# Altium project main_io.PrjPcb (part 3 of 6)

## Sheet can_uart.SchDoc: CAN and UART Interfaces
size A4; Organization: Badgerloop Electrical; Address1: 133 Engineering Research Building; Address2: 1500 Engineering Drive; Address3: Madison, Wi 53706; SheetNumber: 7
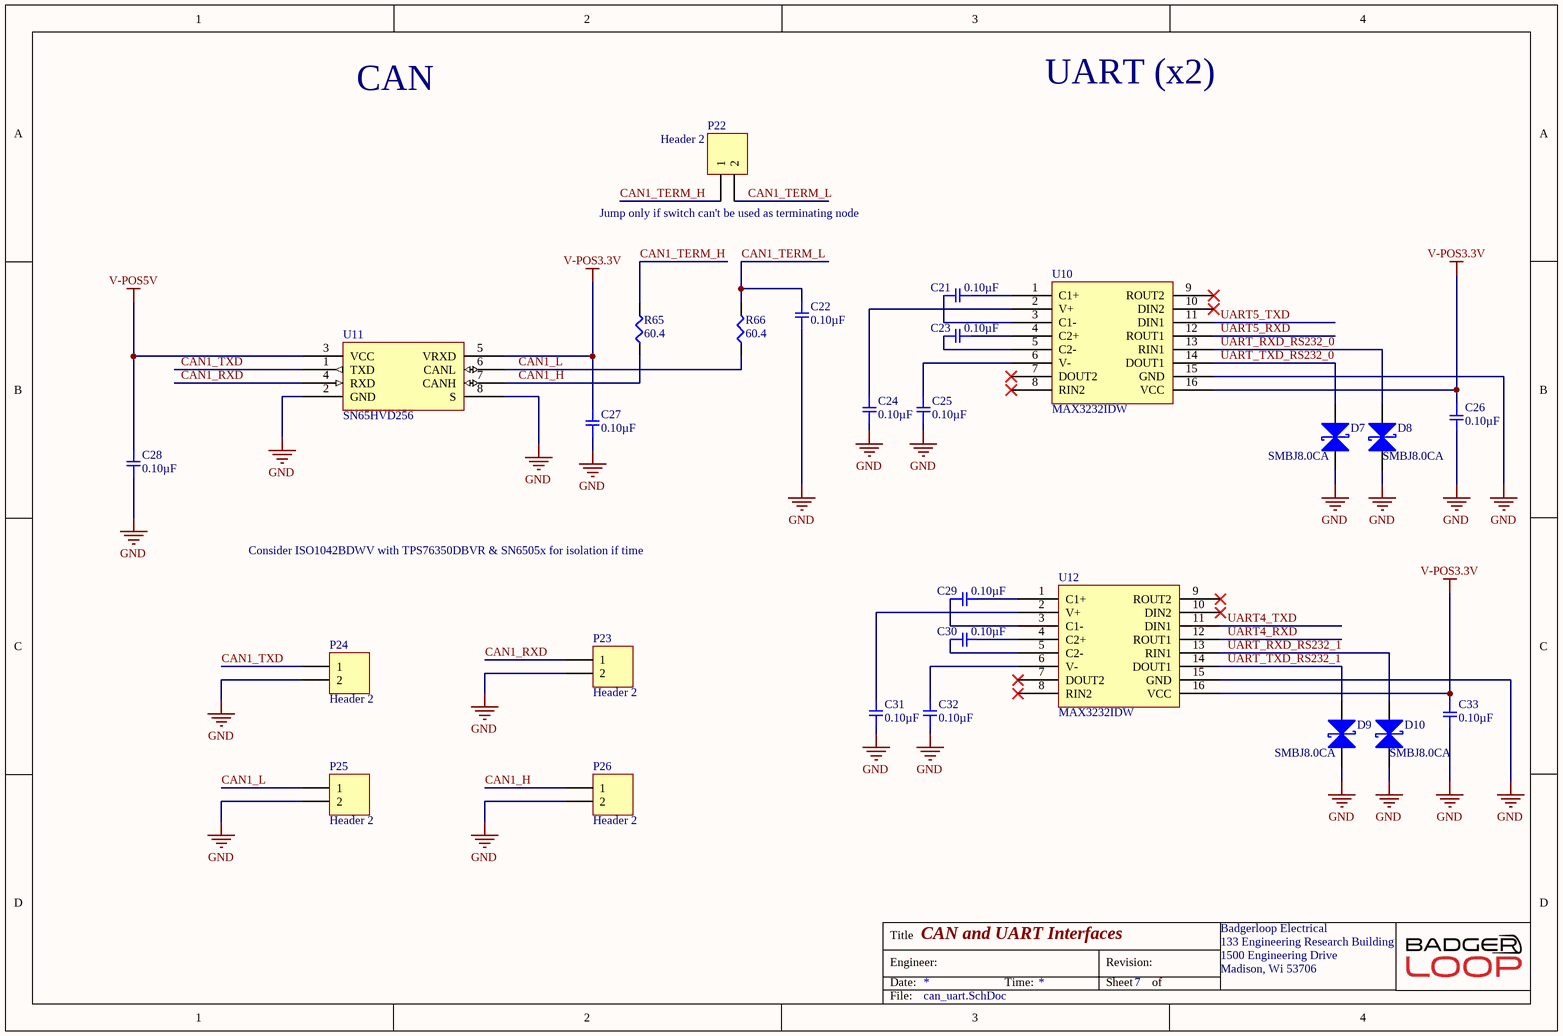
[diagram p6: can_uart.SchDoc]

### Parts
C21  0.10µF  [SMD-0805C]
C22  0.10µF  [SMD-0805C]
C23  0.10µF  [SMD-0805C]
C24  0.10µF  [SMD-0805C]
C25  0.10µF  [SMD-0805C]
C26  0.10µF  [SMD-0805C]
C27  0.10µF  [SMD-0805C]
C28  0.10µF  [SMD-0805C]
C29  0.10µF  [SMD-0805C]
C30  0.10µF  [SMD-0805C]
C31  0.10µF  [SMD-0805C]
C32  0.10µF  [SMD-0805C]
C33  0.10µF  [SMD-0805C]
D7  SMBJ8.0CA  [DIOM4436X26N]
D8  SMBJ8.0CA  [DIOM4436X26N]
D9  SMBJ8.0CA  [DIOM4436X26N]
D10  SMBJ8.0CA  [DIOM4436X26N]
P22  Header 2  [Pin Header 1x2 TH Pitch 2.54mm]
P23  Header 2  [Pin Header 1x2 TH Pitch 2.54mm]
P24  Header 2  [Pin Header 1x2 TH Pitch 2.54mm]
P25  Header 2  [Pin Header 1x2 TH Pitch 2.54mm]
P26  Header 2  [Pin Header 1x2 TH Pitch 2.54mm]
R65  60.4  [SMD-1206-RES]
R66  60.4  [SMD-1206-RES]
U10  MAX3232IDW  [SOP127P1060X175-16N]
U11  SN65HVD256  [SOIC127P610X280-8N]
U12  MAX3232IDW  [SOP127P1060X175-16N]

### Nets
GND: C22.1 C24.1 C25.1 C26.2 C27.1 C28.1 C31.1 C32.1 C33.2 D7.1(A) D8.1(A) D9.1(A) D10.1(A) P23.2 P24.2 P25.2 P26.2 U10.15(GND) U11.2(GND) U11.8(S) U12.15(GND)
V-POS3.3V: C26.1 C27.2 C33.1 U10.16(VCC) U11.5(VRXD) U12.16(VCC)
V-POS5V: C28.2 U11.3(VCC)
CAN1_H: P26.1 R65.1 U11.7(CANH)
CAN1_L: P25.1 R66.1 U11.6(CANL)
CAN1_RXD: P23.1 U11.4(RXD)
CAN1_TERM_H: P22.1 R65.2
CAN1_TERM_L: C22.2 P22.2 R66.2
CAN1_TXD: P24.1 U11.1(TXD)
UART4_RXD: U12.12(ROUT1)
UART4_TXD: U12.11(DIN1)
UART5_RXD: U10.12(ROUT1)
UART5_TXD: U10.11(DIN1)
UART_RXD_RS232_0: D8.2(K) U10.13(RIN1)
UART_RXD_RS232_1: D10.2(K) U12.13(RIN1)
UART_TXD_RS232_0: D7.2(K) U10.14(DOUT1)
UART_TXD_RS232_1: D9.2(K) U12.14(DOUT1)
NetC21_1: C21.1 U10.3(C1-)
NetC21_2: C21.2 U10.1(C1+)
NetC23_1: C23.1 U10.5(C2-)
NetC23_2: C23.2 U10.4(C2+)
NetC24_2: C24.2 U10.2(V+)
NetC25_2: C25.2 U10.6(V-)
NetC29_1: C29.1 U12.3(C1-)
NetC29_2: C29.2 U12.1(C1+)
NetC30_1: C30.1 U12.5(C2-)
NetC30_2: C30.2 U12.4(C2+)
NetC31_2: C31.2 U12.2(V+)
NetC32_2: C32.2 U12.6(V-)

Not connected (* = marked no-connect by the designer): U10 7(DOUT2)* 8(RIN2)* 9(ROUT2)* 10(DIN2)*; U12 7(DOUT2)* 8(RIN2)* 9(ROUT2)* 10(DIN2)*

### Notes on the sheet
- CAN
- UART (x2)
- (near P22) Jump only if switch can't be used as terminating node
- Consider ISO1042BDWV with TPS76350DBVR & SN6505x for isolation if time
- Title
- Engineer:
- Date:
- Time:
- Revision:
- Sheet
- of
- File:

### Library data of the parts
C21-C25 C27-C32 = GRM219R71C104JA01D: CAP CER 0.1UF 16V X7R 0805; Manufacturer: Murata Electronics North America; Factory Stock: 0; Unit Price (USD): 0.12; Minimum Quantity: 1; Tolerance: ±5%; Datasheets: -; Image: //media.digikey.com/Renders/Murata%20Renders/0805%20(2012%20Metric)%20.85mm.jpg; Digi-Key Part Number: 490-12557-1-ND; Part Number: GRM219R71C104JA01D; Quantity Available: 6635; @ qty: 0; Packaging: Cut Tape (CT); Series: GRM; Part Status: Active; Value: 0.10µF; Voltage: 16V; Temperature Coefficient: X7R; Operating Temperature: -55°C ~ 125°C; Features: -; Ratings: -; Applications: General Purpose; Mounting Type: Surface Mount, MLCC; Package / Case: 0805 (2012 Metric); Size / Dimension: 0.079" L x 0.049" W (2.00mm x 1.25mm); Height - Seated (Max): -; Thickness (Max): 0.037" (0.95mm); Lead Spacing: -; Lead Style: -
C26 C33 = GRM219R71E104KA01D: CAP CER 0.1UF 25V X7R 0805; Manufacturer: Murata Electronics North America; Factory Stock: 0; Unit Price (USD): 0.12; Minimum Quantity: 1; Tolerance: ±10%; Datasheets: http://www.murata.com/~/media/webrenewal/support/library/catalog/products/capacitor/mlcc/c02e.pdf; Image: //media.digikey.com/Renders/Murata%20Renders/0805%20(2012%20Metric)%20.85mm.jpg; Digi-Key Part Number: 490-12754-1-ND; Part Number: GRM219R71E104KA01D; Quantity Available: 8594; @ qty: 0; Packaging: Cut Tape (CT); Series: GRM; Part Status: Active; Value: 0.10µF; Voltage: 25V; Temperature Coefficient: X7R; Operating Temperature: -55°C ~ 125°C; Features: -; Ratings: -; Applications: General Purpose; Mounting Type: Surface Mount, MLCC; Package / Case: 0805 (2012 Metric); Size / Dimension: 0.079" L x 0.049" W (2.00mm x 1.25mm); Height - Seated (Max): -; Thickness (Max): 0.037" (0.95mm); Lead Spacing: -; Lead Style: -
D7-D10 = SMBJ8.0CA: TVS DIODE 8V 13.6V DO214AA; Manufacturer: Littelfuse; Polarity: Bidirectional; Peak Pulse Power: 600W; Max Surge Current: 44.2A; Breakdown Voltage: 8.89V; Test Current: 1mA; Number of Channels: 1; Leakage Current: 100uA; Power Line Protection: No; Max Breakdown Voltage: 9.83V; Supplier 1: Digi-Key; Stock 1: 700; Pricing 1: 1=0.39, 10=0.313, 25=0.2864, 100=0.1798, 250=0.17784, 500=0.1665, 1000=0.11322 (USD); Mount: Surface Mount; Case/Package: SMB; Number of Pins: 2; Min Operating Temperature: -65°C; Max Operating Temperature: 150°C; Packaging: Tape and Reel; Clamping Voltage: 13.6V; Package Quantity: 3000; Reverse Standoff Voltage: 8V; Min Breakdown Voltage: 8.89V; Peak Pulse Current: 44.2A; Direction: Bidirectional; Reverse Breakdown Voltage: 8.89V; Operating Supply Voltage: 8V; Termination: SMD/SMT; Number of Elements: 1; Number of Bidirectional Channels: 1; Composition: Zener; Max Power Dissipation: 600W; Voltage Rating (DC): 8V; Power Dissipation: 600W; Length: 5.59mm; Height: 2.44mm; Width: 3.94mm; Lead Free: Lead Free; REACH SVHC: No SVHC; ComponentLink1URL: http://www.littelfuse.com/~/media/electronics/datasheets/tvs_diodes/littelfuse_tvs_diode_smbj_datasheet.pdf.pdf?src-supplier=Digi-Key; ComponentLink1Description: http://www.littelfuse.com/~/media/electronics/datasheets/tvs_diodes/littelfuse_tvs_diode_smbj_datasheet.pdf.pdf?src-supplier=Digi-Key; ComponentLink2URL: http://www.littelfuse.com/data/en/Data_Sheets/Littelfuse_TVS-Diode_SMBJ.pdf?src-supplier=Element14; ComponentLink2Description: http://www.littelfuse.com/data/en/Data_Sheets/Littelfuse_TVS-Diode_SMBJ.pdf?src-supplier=Element14; Supplier Part Number 1: SMBJ8.0CALFCT-ND
P22-P26 = Header 2: Header, 2-Pin; LatestRevisionDate: 17-Jul-2002; LatestRevisionNote: Re-released for DXP Platform.; Publisher: Altium Limited
R65 R66 = ERJ-8ENF60R4V: RES SMD 60.4 OHM 1% 1/4W 1206; Manufacturer: Panasonic Electronic Components; Factory Stock: 0; Unit Price (USD): 0.00933; @ qty: 1500; Minimum Quantity: 1; Power (Watts): 0.25W, 1/4W; Temperature Coefficient: ±100ppm/°C; Part Number: ERJ-8ENF60R4V; Datasheets: http://industrial.panasonic.com/www-cgi/jvcr13pz.cgi?E+PZ+3+AOA0002+ERJ8ENF60R4V+7+WW; Image: //media.digikey.com/Renders/Panasonic%20Renders/ERJ-1206%20Pkg.jpg; Digi-Key Part Number: P60.4FCT-ND; Quantity Available: 94102; Packaging: Cut Tape (CT); Series: ERJ; Part Status: Active; Value: 60.4; Tolerance: ±1%; Composition: Thick Film; Features: Automotive AEC-Q200; Operating Temperature: -55°C ~ 155°C; Package / Case: 1206 (3216 Metric); Supplier Device Package: 1206; Size / Dimension: 0.126" L x 0.063" W (3.20mm x 1.60mm); Height - Seated (Max): 0.028" (0.70mm); Number of Terminations: 2; Failure Rate: -
U10 U12 = MAX3232IDW: IC DRVR/RCVR MULTCH RS232 16SOIC; Manufacturer: Texas Instruments; Number of Transmitters: 2; Max Supply Voltage: 5.5V; Min Supply Voltage: 3V; Nominal Supply Current: 1mA; Data Rate: 250Kbps; Logic Function: Transceiver,Receiver; Number of Transceivers: 1; Operating Supply Voltage: 5V; Simplex/Duplex: Full Duplex; Output Voltage: 5.4V; Output Current: 60mA; Supplier 1: Digi-Key; Stock 1: 419; Pricing 1: 1=2.15, 10=1.927, 25=1.818, 100=1.4543, 250=1.27252, 500=1.23618, 1000=0.98167, 2500=0.9604 (USD); Mount: Surface Mount; Case/Package: SOIC; Number of Pins: 16; Weight: 0.014829oz; Min Operating Temperature: -40°C; Max Operating Temperature: 85°C; Packaging: Rail/Tube; Number of Receivers: 2; Package Quantity: 40; Number of Drivers: 2; Length: 10.28mm; Width: 7.52mm; Height: 2.35mm; Radiation Hardening: No; Lead Free: Lead Free; RoHS Compliant: Yes; REACH SVHC: No SVHC; ComponentLink1URL: http://www.farnell.com/datasheets/1823586.pdf?src-supplier=Element14; ComponentLink1Description: http://www.farnell.com/datasheets/1823586.pdf?src-supplier=Element14; ComponentLink2URL: http://www.ti.com/lit/ds/symlink/max3232.pdf?src-supplier=Digi-Key; ComponentLink2Description: http://www.ti.com/lit/ds/symlink/max3232.pdf?src-supplier=Digi-Key; ComponentLink3URL: http://focus.ti.com/lit/ds/symlink/max3232.pdf?src-supplier=Avnet+Europe; ComponentLink3Description: http://focus.ti.com/lit/ds/symlink/max3232.pdf?src-supplier=Avnet+Europe; ComponentLink4URL: http://www.produktinfo.conrad.com/datenblaetter/1100000-1199999/001187156-da-01-en-IC_DRVR_RCVR_MULT_MAX3232IDW_SOIC_16_TID.pdf?src-supplier=Conrad; ComponentLink4Description: http://www.produktinfo.conrad.com/datenblaetter/1100000-1199999/001187156-da-01-en-IC_DRVR_RCVR_MULT_MAX3232IDW_SOIC_16_TID.pdf?src-supplier=Conrad; Supplier Part Number 1: 296-26159-5-ND
U11 = SN65HVD256: IC TXRX CAN 5V HS 8SOIC; Manufacturer: TI; Manufacturer P/N: SN65HVD256DR; Digikey P/N: 296-30093-1-ND; Digikey Link: https://www.digikey.com/product-detail/en/texas-instruments/SN65HVD256DR/296-30093-1-ND/2798832

## Sheet retros.SchDoc: Retros
size A4; Organization: Badgerloop Electrical; Address1: 133 Engineering Research Building; Address2: 1500 Engineering Drive; Address3: Madison, Wi 53706; SheetNumber: 8
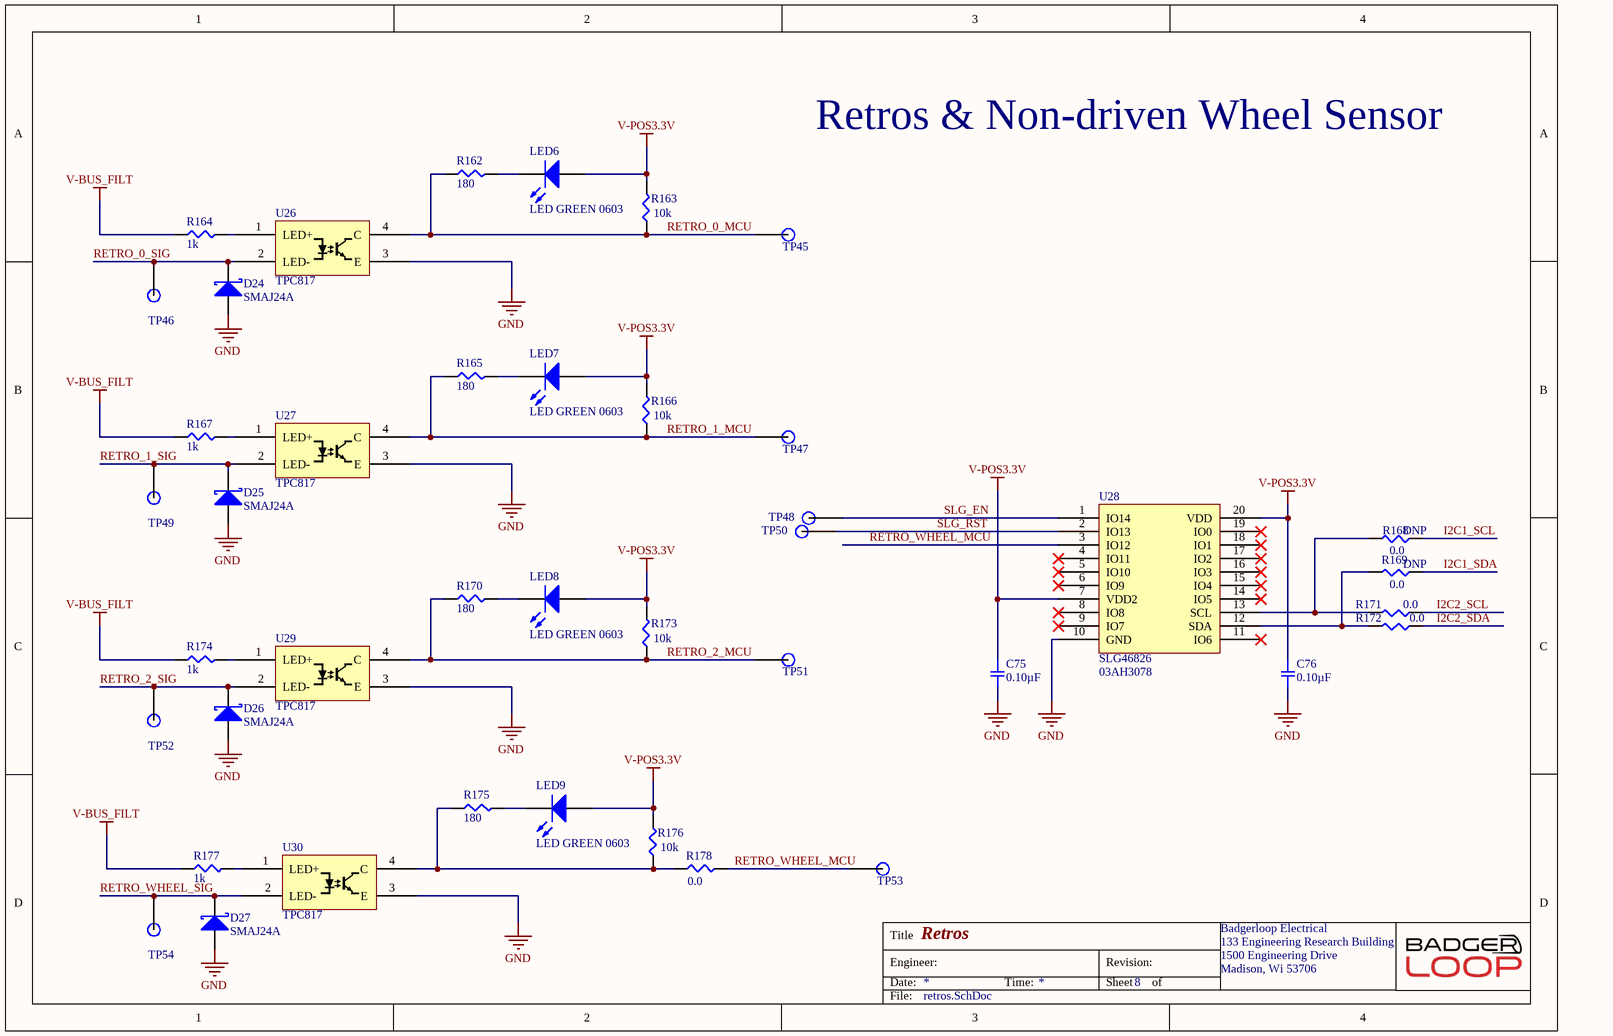
[diagram p7: retros.SchDoc]

### Parts
C75  0.10µF  [SMD-0805C]
C76  0.10µF  [SMD-0805C]
D24  SMAJ24A  [INDM5026X18N]
D25  SMAJ24A  [INDM5026X18N]
D26  SMAJ24A  [INDM5026X18N]
D27  SMAJ24A  [INDM5026X18N]
LED6  LED GREEN 0603  [LED 0603 GREEN]
LED7  LED GREEN 0603  [LED 0603 GREEN]
LED8  LED GREEN 0603  [LED 0603 GREEN]
LED9  LED GREEN 0603  [LED 0603 GREEN]
R162  180  [SMD-0805-RES]
R163  10k  [SMD-0805-RES]
R164  1k  [SMD-0805-RES]
R165  180  [SMD-0805-RES]
R166  10k  [SMD-0805-RES]
R167  1k  [SMD-0805-RES]
R168  0.0  [SMD-0805-RES]
R169  0.0  [SMD-0805-RES]
R170  180  [SMD-0805-RES]
R171  0.0  [SMD-0805-RES]
R172  0.0  [SMD-0805-RES]
R173  10k  [SMD-0805-RES]
R174  1k  [SMD-0805-RES]
R175  180  [SMD-0805-RES]
R176  10k  [SMD-0805-RES]
R177  1k  [SMD-0805-RES]
R178  0.0  [SMD-0805-RES]
TP45  TP  [Test Point]  (value not drawn)
TP46  TP  [Test Point]  (value not drawn)
TP47  TP  [Test Point]  (value not drawn)
TP48  TP  [Test Point]  (value not drawn)
TP49  TP  [Test Point]  (value not drawn)
TP50  TP  [Test Point]  (value not drawn)
TP51  TP  [Test Point]  (value not drawn)
TP52  TP  [Test Point]  (value not drawn)
TP53  TP  [Test Point]  (value not drawn)
TP54  TP  [Test Point]  (value not drawn)
U26  TPC817  [SOT200P1005X328-5N]
U27  TPC817  [SOT200P1005X328-5N]
U28  SLG46826  Supplier Part Number 1: 03AH3078  [SOP65P640X175-20N]
U29  TPC817  [SOT200P1005X328-5N]
U30  TPC817  [SOT200P1005X328-5N]

### Nets
GND: C75.2 C76.2 D24.2(K) D25.2(K) D26.2(K) D27.2(K) U26.3(E) U27.3(E) U28.10(GND) U29.3(E) U30.3(E)
V-BUS_FILT: R164.1 R167.1 R174.1 R177.1  [project net MSTR_SW +]
V-POS3.3V: C75.1 C76.1 LED6.1(A) LED7.1(A) LED8.1(A) LED9.1(A) R163.2 R166.2 R173.2 R176.2 U28.7(VDD2) U28.20(VDD)
I2C1_SCL: R168.1
I2C1_SDA: R169.1
I2C2_SCL: R171.1
I2C2_SDA: R172.1
RETRO_0_MCU: R162.1 R163.1 TP45.1 U26.4(C)
RETRO_0_SIG: D24.1(A) TP46.1 U26.2(LED-)
RETRO_1_MCU: R165.1 R166.1 TP47.1 U27.4(C)
RETRO_1_SIG: D25.1(A) TP49.1 U27.2(LED-)
RETRO_2_MCU: R170.1 R173.1 TP51.1 U29.4(C)
RETRO_2_SIG: D26.1(A) TP52.1 U29.2(LED-)
RETRO_WHEEL_MCU: R178.2 TP53.1 U28.3(IO12)
RETRO_WHEEL_SIG: D27.1(A) TP54.1 U30.2(LED-)
SLG_EN: TP48.1 U28.1(IO14)
SLG_RST: TP50.1 U28.2(IO13)
NetLED6_2: LED6.2(K) R162.2
NetLED7_2: LED7.2(K) R165.2
NetLED8_2: LED8.2(K) R170.2
NetLED9_2: LED9.2(K) R175.2
NetR164_2: R164.2 U26.1(LED+)
NetR167_2: R167.2 U27.1(LED+)
NetR168_2: R168.2 R171.2 U28.13(SCL)
NetR169_2: R169.2 R172.2 U28.12(SDA)
NetR174_2: R174.2 U29.1(LED+)
NetR175_1: R175.1 R176.1 R178.1 U30.4(C)
NetR177_2: R177.2 U30.1(LED+)

Not connected (* = marked no-connect by the designer): U28 4(IO11)* 5(IO10)* 6(IO9)* 8(IO8)* 9(IO7)* 11(IO6)* 14(IO5)* 15(IO4)* 16(IO3)* 17(IO2)* 18(IO1)* 19(IO0)*

### Notes on the sheet
- Retros & Non-driven Wheel Sensor
- Title
- Engineer:
- Date:
- Time:
- Revision:
- Sheet
- of
- File:

### Library data of the parts
C75 C76 = GRM219R71E104KA01D: as C26 on sheet can_uart; Datasheets: http://www.murata.com/~/media/webrenewal/support/library/catalog/products/capacitor/mlcc/c02e.pdf; Image: //media.digikey.com/Renders/Murata%20Renders/0805%20(2012%20Metric)%20.85mm.jpg; Digi-Key Part Number: 490-12754-1-ND; Part Number: GRM219R71E104KA01D; Quantity Available: 8594; @ qty: 0; Packaging: Cut Tape (CT); Series: GRM; Part Status: Active; Value: 0.10µF; Voltage: 25V; Temperature Coefficient: X7R; Operating Temperature: -55°C ~ 125°C; Features: -; Ratings: -; Applications: General Purpose; Mounting Type: Surface Mount, MLCC; Package / Case: 0805 (2012 Metric); Size / Dimension: 0.079" L x 0.049" W (2.00mm x 1.25mm); Height - Seated (Max): -; Thickness (Max): 0.037" (0.95mm); Lead Spacing: -; Lead Style: -
D24-D27 = SMAJ24A: TVS DIODE 24V 38.9V DO214AC; Manufacturer: LittelFuse Inc; Digikey P/N: SMAJ24ALFCT-ND; Digikey Link: https://www.digikey.com/product-detail/en/littelfuse-inc/SMAJ24A/SMAJ24ALFCT-ND/762500; Manufacturer P/N: SMAJ24A
LED6-LED9 = LED GREEN 0603: Manufacturer: Lite-On Inc.; Manufacturer P/N: LTST-C190KGKT; Digikey P/N: 160-1435-1-ND; Package / Case: 0603; Color: GREEN
R162 R165 R170 R175 = ERJ-6ENF1800V: RES SMD 180 OHM 1% 1/8W 0805; Manufacturer: Panasonic Electronic Components; Factory Stock: 0; Unit Price (USD): 0.00729; @ qty: 1500; Minimum Quantity: 1; Power (Watts): 0.125W, 1/8W; Temperature Coefficient: ±100ppm/°C; Part Number: ERJ-6ENF1800V; Datasheets: http://industrial.panasonic.com/www-cgi/jvcr13pz.cgi?E+PZ+3+AOA0002+ERJ6ENF1800V+7+WW; Image: //media.digikey.com/Renders/Panasonic%20Renders/ERJ-0805%20Pkg.jpg; Digi-Key Part Number: P180CCT-ND; Quantity Available: 33231; Packaging: Cut Tape (CT); Series: ERJ; Part Status: Active; Value: 180; Tolerance: ±1%; Composition: Thick Film; Features: Automotive AEC-Q200; Operating Temperature: -55°C ~ 155°C; Package / Case: 0805 (2012 Metric); Supplier Device Package: 0805; Size / Dimension: 0.079" L x 0.049" W (2.00mm x 1.25mm); Height - Seated (Max): 0.028" (0.70mm); Number of Terminations: 2; Failure Rate: -
R163 R166 R173 R176 = ERJ-6GEYJ103V: RES SMD 10K OHM 5% 1/8W 0805; Manufacturer: Panasonic Electronic Components; Factory Stock: 0; Unit Price (USD): 0.00496; @ qty: 1500; Minimum Quantity: 1; Power (Watts): 0.125W, 1/8W; Temperature Coefficient: ±200ppm/°C; Part Number: ERJ-6GEYJ103V; Datasheets: http://industrial.panasonic.com/www-cgi/jvcr13pz.cgi?E+PZ+3+AOA0001+ERJ6GEYJ103V+7+WW; Image: //media.digikey.com/Renders/Panasonic%20Renders/ERJ-0805%20Pkg.jpg; Digi-Key Part Number: P10KACT-ND; Quantity Available: 2328224; Packaging: Cut Tape (CT); Series: ERJ; Part Status: Active; Value: 10k; Tolerance: ±5%; Composition: Thick Film; Features: Automotive AEC-Q200; Operating Temperature: -55°C ~ 155°C; Package / Case: 0805 (2012 Metric); Supplier Device Package: 0805; Size / Dimension: 0.079" L x 0.049" W (2.00mm x 1.25mm); Height - Seated (Max): 0.028" (0.70mm); Number of Terminations: 2; Failure Rate: -
R164 R167 R174 R177 = ERJ-6ENF1001V: RES SMD 1K OHM 1% 1/8W 0805; Manufacturer: Panasonic Electronic Components; Factory Stock: 0; Unit Price (USD): 0.00729; @ qty: 1500; Minimum Quantity: 1; Power (Watts): 0.125W, 1/8W; Temperature Coefficient: ±100ppm/°C; Part Number: ERJ-6ENF1001V; Datasheets: http://industrial.panasonic.com/www-cgi/jvcr13pz.cgi?E+PZ+3+AOA0002+ERJ6ENF1001V+7+WW; Image: //media.digikey.com/Renders/Panasonic%20Renders/ERJ-0805%20Pkg.jpg; Digi-Key Part Number: P1.00KCCT-ND; Quantity Available: 12895103; Packaging: Cut Tape (CT); Series: ERJ; Part Status: Active; Value: 1k; Tolerance: ±1%; Composition: Thick Film; Features: Automotive AEC-Q200; Operating Temperature: -55°C ~ 155°C; Package / Case: 0805 (2012 Metric); Supplier Device Package: 0805; Size / Dimension: 0.079" L x 0.049" W (2.00mm x 1.25mm); Height - Seated (Max): 0.028" (0.70mm); Number of Terminations: 2; Failure Rate: -
R168 R169 R171 R172 R178 = ERJ-6GEY0R00V: RES SMD 0.0 OHM JUMPER 1/8W 0805; Manufacturer: Panasonic Electronic Components; Factory Stock: 0; Unit Price (USD): 0.00544; @ qty: 1500; Minimum Quantity: 1; Power (Watts): 0.125W, 1/8W; Part Number: ERJ-6GEY0R00V; Datasheets: http://industrial.panasonic.com/www-cgi/jvcr13pz.cgi?E+PZ+3+AOA0001+ERJ6GEY0R00V+7+WW; Image: //media.digikey.com/Renders/Panasonic%20Renders/ERJ-0805%20Pkg.jpg; Digi-Key Part Number: P0.0ACT-ND; Quantity Available: 1597627; Packaging: Cut Tape (CT); Series: ERJ; Part Status: Active; Value: 0.0; Tolerance: Jumper; Composition: Thick Film; Features: Automotive AEC-Q200; Temperature Coefficient: -; Operating Temperature: -55°C ~ 155°C; Package / Case: 0805 (2012 Metric); Supplier Device Package: 0805; Size / Dimension: 0.079" L x 0.049" W (2.00mm x 1.25mm); Height - Seated (Max): 0.028" (0.70mm); Number of Terminations: 2; Failure Rate: -
  R168 R169: DNP: DNP
TP45-TP54 = TP: SMD TEST POINT
U26 U27 U29 U30 = TPC817: OPTOISO 5KV TRANS 4SOP; Manufacturer: Taiwan Semi; Manufacturer P/N: TPC817S1B RAG; Digikey Link: https://www.digikey.com/product-detail/en/taiwan-semiconductor-corporation/TPC817S1B-RAG/TPC817S1BRAGCT-ND/7359679; Digikey P/N: TPC817S1BRAGCT-ND
U28 = SLG46826: GreenPAK Programmable Mixed Signal Matrix with In-System Programmability; Manufacturer: Dialog Semiconductor; Manufacturer Part Number: SLG46826V-SKT; Supplier 1: Newark; Stock 1: 4; Pricing 1: 1=45.65000, 5=44.43000, 10=43.15000, 25=42.51000, 50=41.89000, 100=39.38000 (USD); RoHS: No

## Sheet arduino_shield.SchDoc: Arduino Shield
size A4; Organization: Badgerloop Electrical; Address1: 133 Engineering Research Building; Address2: 1500 Engineering Drive; Address3: Madison, Wi 53706; SheetNumber: 9
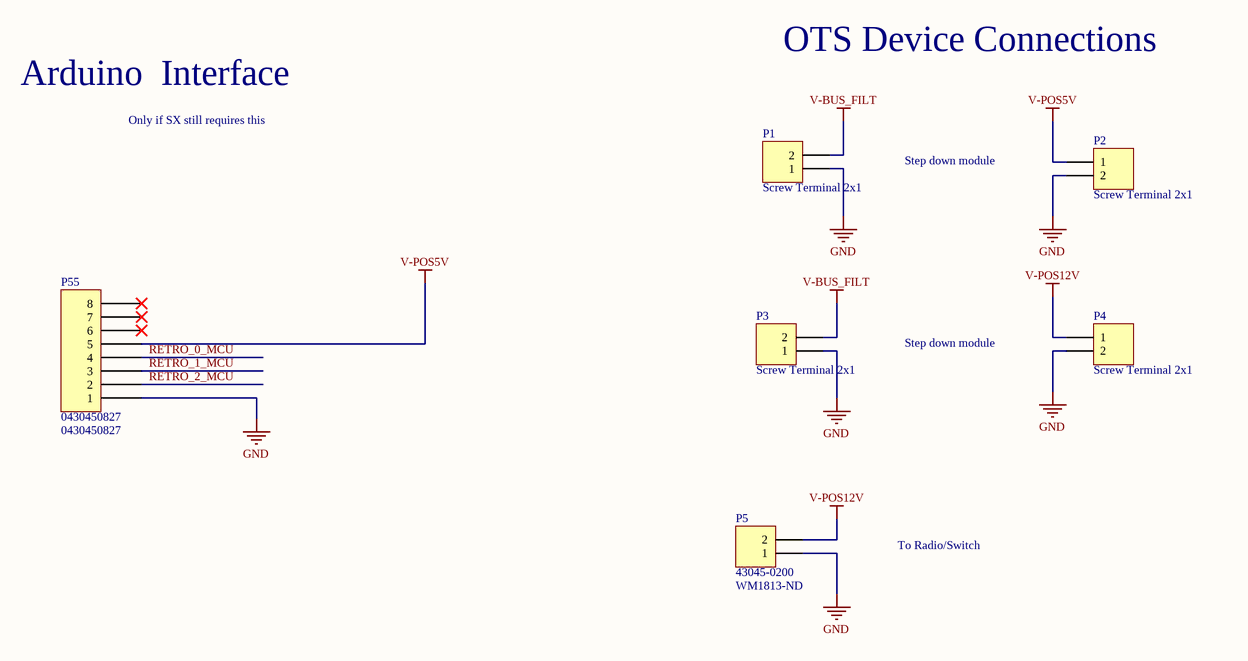
[diagram p8: arduino_shield.SchDoc]

### Parts
P1  Screw Terminal 2x1  [2POS TERM BLOCK]
P2  Screw Terminal 2x1  [2POS TERM BLOCK]
P3  Screw Terminal 2x1  [2POS TERM BLOCK]
P4  Screw Terminal 2x1  [2POS TERM BLOCK]
P5  43045-0200  Supplier Part Number 1: WM1813-ND  [430450200]
P55  0430450827  [0430450827]

### Nets
GND: P1.1 P2.2 P3.1 P4.2 P5.1 P55.1
V-BUS_FILT: P1.2 P3.2  [project net MSTR_SW +]
V-POS5V: P2.1 P55.5
V-POS12V: P4.1 P5.2
RETRO_0_MCU: P55.4
RETRO_1_MCU: P55.3
RETRO_2_MCU: P55.2

Not connected (* = marked no-connect by the designer): P55 6* 7* 8*

### Notes on the sheet
- Arduino  Interface
- OTS Device Connections
- Only if SX still requires this
- Step down module
- To Radio/Switch
- Title
- Engineer:
- Date:
- Time:
- Revision:
- Sheet
- of
- File:

### Library data of the parts
P1-P4 = Screw Terminal 2x1: Screw Terminal, 2-Pin
P5 = 43045-0200: CONN HEADER R/A 2POS; Manufacturer: Molex; Contact Resistance: 10mR; Number of Contacts: 2; Voltage Rating: 600V; Current Rating: 5A; Gender: Male; Max Voltage Rating (DC): 250.25kV; Voltage Rating (DC): 250V; Insulation Resistance: 1GR; Pitch: 3mm; Glow Wire Compliant: Compliant; Approvals: UL,CSA,TUV; Supplier 1: Digi-Key; Manufacturer Part Number: 43045-0200; Stock 1: 6320; Pricing 1: 1=0.97000, 10=0.84900, 100=0.73280, 500=0.59958, 1000=0.53296, 5000=0.46634, 10000=0.44302 (USD); RoHS: Yes; Mount: Through Hole; Case/Package: SMC; Contact Plating: Tin; Color: Black; Contact Material: Brass,Tin; Housing Color: Black; Housing Material: Thermoplastic; Material: Thermoplastic; Min Operating Temperature: -40°C; Max Operating Temperature: 105°C; Termination: Through Hole; Number of Rows: 2; Orientation: Right Angle; Packaging: Tray; Number of Positions: 2; Package Quantity: 3168; Number of Circuits: 2; Contact Gender: Male; Diameter: 3mm; Row Spacing: 3mm; Radiation Hardening: No; Flammability Rating: UL94 V-0; REACH SVHC: Unknown; Lead Free: Lead Free; Halogen Free: Low Halogen; ComponentLink1URL: https://datasheet.ciiva.com/14155/04402310-14155203.pdf?src-supplier=Distrelec; ComponentLink1Description: https://datasheet.ciiva.com/14155/04402310-14155203.pdf?src-supplier=Distrelec; ComponentLink2URL: https://datasheet.ciiva.com/19454/883270-19454006.pdf?src-supplier=Jameco; ComponentLink2Description: https://datasheet.ciiva.com/19454/883270-19454006.pdf?src-supplier=Jameco; ComponentLink3URL: https://datasheet.ciiva.com/5150/0430450200-pcb-headers-145770-5150407.pdf?src-supplier=Mouser; ComponentLink3Description: https://datasheet.ciiva.com/5150/0430450200-pcb-headers-145770-5150407.pdf?src-supplier=Mouser; ComponentLink4URL: https://datasheet.ciiva.com/11747/0900766b80027348-11747001.pdf?src-supplier=RSComponents; ComponentLink4Description: https://datasheet.ciiva.com/11747/0900766b80027348-11747001.pdf?src-supplier=RSComponents; ComponentLink5URL: https://datasheet.ciiva.com/16656/0430450200-pcb-headers-16656330.pdf?src-supplier=Avnet+Europe; ComponentLink5Description: https://datasheet.ciiva.com/16656/0430450200-pcb-headers-16656330.pdf?src-supplier=Avnet+Europe; ComponentLink6URL: https://datasheet.ciiva.com/10090/0430450200-pcb-headers-10090299.pdf?src-supplier=Avnet; ComponentLink6Description: https://datasheet.ciiva.com/10090/0430450200-pcb-headers-10090299.pdf?src-supplier=Avnet; ComponentLink7URL: https://datasheet.ciiva.com/36854/124280430450200-pcb-headers-36854331.pdf?src-supplier=Onlinecomponents.com; ComponentLink7Description: https://datasheet.ciiva.com/36854/124280430450200-pcb-headers-36854331.pdf?src-supplier=Onlinecomponents.com; ComponentLink8URL: https://datasheet.ciiva.com/1443/1859921-1443437.pdf?src-supplier=Element14; ComponentLink8Description: https://datasheet.ciiva.com/1443/1859921-1443437.pdf?src-supplier=Element14
P55 = 0430450827: CONN HEADER VERT 8POS 3MM; Manufacturer: Molex; Number of Positions: 8; Contact Resistance: 10mR; Max Voltage Rating (AC): 250V; Connector Type: Male Pin; Row Spacing: 0.118inch; Supplier 1: Digi-Key; Stock 1: 5300; Pricing 1: 1=1.67, 10=1.519, 25=1.4256, 50=1.3636, 100=1.3016, 250=1.17764, 500=1.08466, 1000=0.9297, 2500=0.86772 (USD); Mount: Through Hole; Contact Plating: Tin; Contact Material: Brass; Housing Material: Polymer; Color: Black; Housing Color: Black; Min Operating Temperature: -40°C; Max Operating Temperature: 105°C; Number of Rows: 2; Packaging: Tray; Termination: Solder; Number of Contacts: 8; Orientation: Straight; Package Quantity: 1440; Fastening Type: Ramp; Length: 16.15mm; Pitch: 3mm; Depth: 8.77mm; ComponentLink1URL: http://www.molex.com/pdm_docs/sd/430450827_sd.pdf?src-supplier=Digi-Key; ComponentLink1Description: http://www.molex.com/pdm_docs/sd/430450827_sd.pdf?src-supplier=Digi-Key; Supplier Part Number 1: WM10684-ND; Manufacturer Part Number: 0430450827

## Sheet bms_interface.SchDoc: BMS Interface
size A4; Engineer: Shelby Riggleman; Organization: Badgerloop Electrical; Address1: 133 Engineering Research Building; Address2: 1500 Engineering Drive; Address3: Madison, Wi 53706; Revision: A; SheetNumber: 10
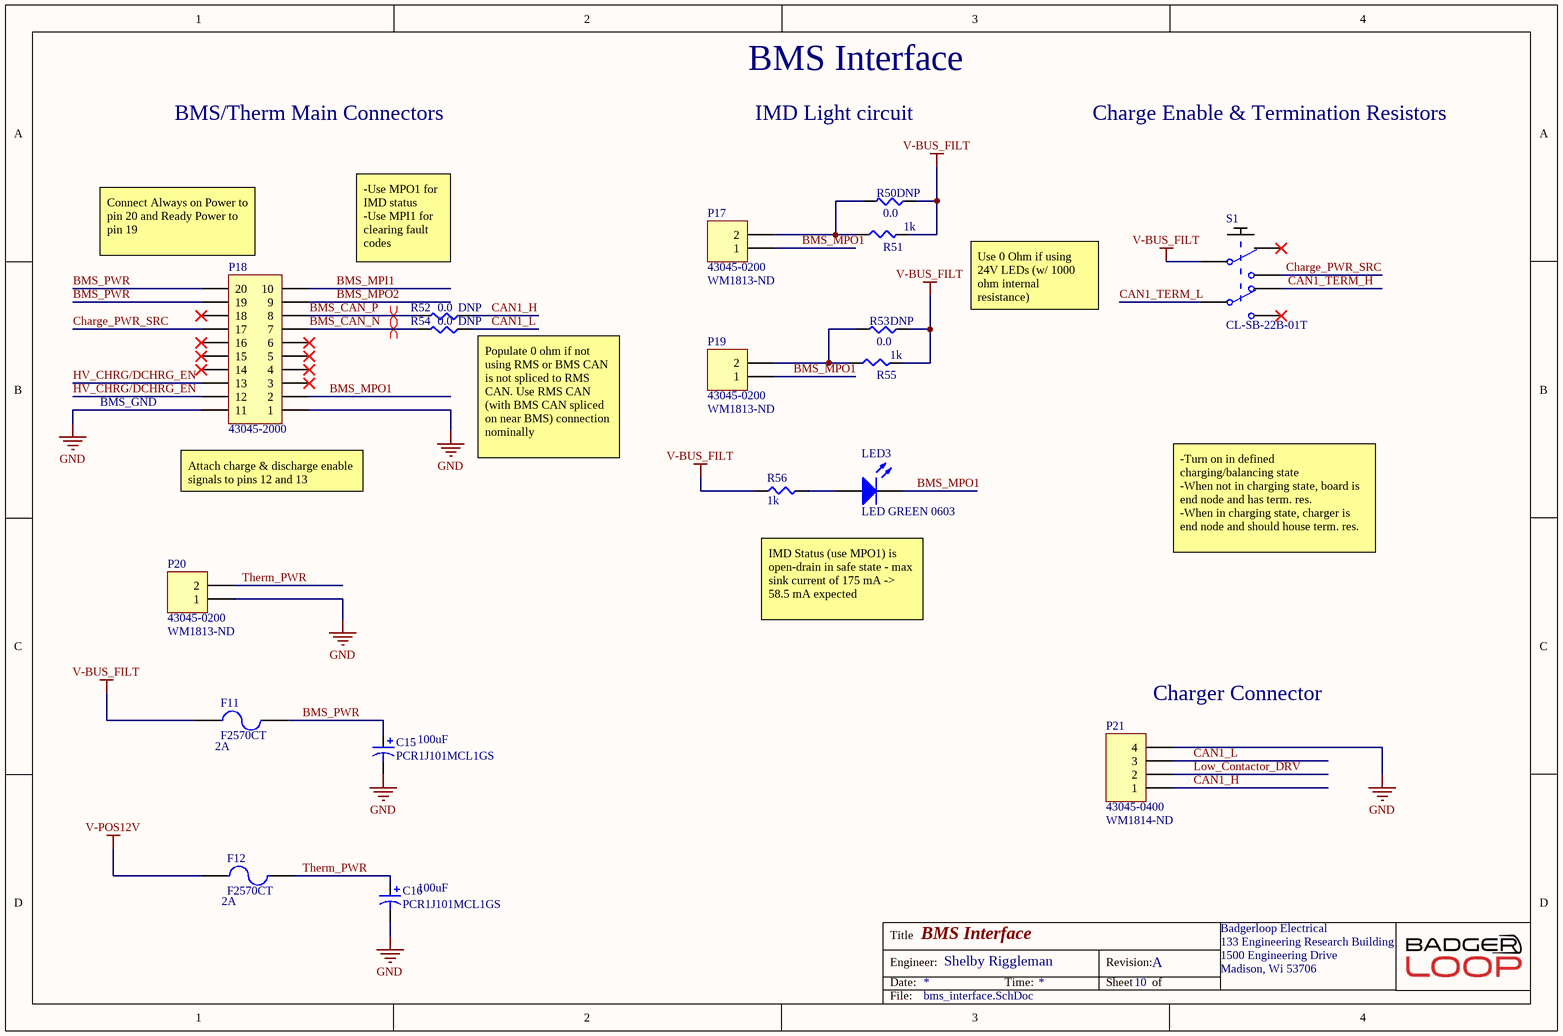
[diagram p9: bms_interface.SchDoc]

### Parts
C15  PCR1J101MCL1GS  Capacitance: 100uF  [CAPAE110103X126M]
C16  PCR1J101MCL1GS  Capacitance: 100uF  [CAPAE110103X126M]
F11  F2570CT  Current Rating: 2A  [SMD-1206-RES]
F12  F2570CT  Current Rating: 2A  [SMD-1206-RES]
LED3  LED GREEN 0603  [LED 0603 GREEN]
P17  43045-0200  Supplier Part Number 1: WM1813-ND  [430450200]
P18  43045-2000  [430452000]
P19  43045-0200  Supplier Part Number 1: WM1813-ND  [430450200]
P20  43045-0200  Supplier Part Number 1: WM1813-ND  [430450200]
P21  43045-0400  Supplier Part Number 1: WM1814-ND  [430450400]
R50  0.0  [SMD-0805-RES]
R51  1k  [SMD-0805-RES]
R52  0.0  [SMD-0805-RES]
R53  0.0  [SMD-0805-RES]
R54  0.0  [SMD-0805-RES]
R55  1k  [SMD-0805-RES]
R56  1k  [SMD-0805-RES]
S1  CL-SB-22B-01T  [SOP250P500X350-6N]

### Nets
GND: C15.2 C16.2 P18.1 P18.11 P20.1 P21.4
V-BUS_FILT: F11.1 R50.1 R51.2 R53.1 R55.2 R56.1 S1.2  [project net MSTR_SW +]
V-POS12V: F12.1
BMS_CAN_N: P18.7 R54.2
BMS_CAN_P: P18.8 R52.2
BMS_MPI1: P18.10
BMS_MPO1: LED3.2(K) P17.1 P18.2 P19.1
BMS_MPO2: P18.9
BMS_PWR: C15.1 F11.2 P18.19 P18.20
CAN1_H: P21.1 R52.1
CAN1_L: P21.3 R54.1
CAN1_TERM_H: S1.4
CAN1_TERM_L: S1.5
Charge_PWR_SRC: P18.17 S1.3
HV_CHRG/DCHRG_EN: P18.12 P18.13
Low_Contactor_DRV: P21.2
Therm_PWR: C16.1 F12.2 P20.2
NetLED3_1: LED3.1(A) R56.2
NetP17_2: P17.2 R50.2 R51.1
NetP19_2: P19.2 R53.2 R55.1

Not connected (* = marked no-connect by the designer): P18 3* 4* 5* 6* 14* 15* 16* 18*; S1 1* 6*

### Layout directives
differential pair: BMS_CAN_N, BMS_CAN_P

### Notes on the sheet
- BMS Interface
- BMS/Therm Main Connectors
- IMD Light circuit
- Charge Enable & Termination Resistors
- (near P18) Connect Always on Power to pin 20 and Ready Power to pin 19
- -Use MPO1 for IMD status
  -Use MPI1 for clearing fault codes
- Use 0 Ohm if using 24V LEDs (w/ 1000 ohm internal resistance)
- BMS_GND
- (near P18) Attach charge & discharge enable signals to pins 12 and 13
- Populate 0 ohm if not using RMS or BMS CAN is not spliced to RMS CAN. Use RMS CAN (with BMS CAN spliced on near BMS) connection nominally
- -Turn on in defined charging/balancing state
  -When not in charging state, board is end node and has term. res.
  -When in charging state, charger is end node and should house term. res.
- IMD Status (use MPO1) is open-drain in safe state - max sink current of 175 mA -> 58.5 mA expected
- (near P21) Charger Connector
- Title
- Engineer:
- Date:
- Time:
- Revision:
- Sheet
- of
- File:

### Library data of the parts
C15 C16 = PCR1J101MCL1GS: CAP ALUM POLY 100UF 20% 63V SMD; Manufacturer: Nichicon; ESR (Equivalent Series Resistance): 24mR; Ripple Current: 3A; Leakage Current: 3uA; Life (Hours): 4000Hour; Dissipation Factor: 0.08%; Supplier 1: Digi-Key; Manufacturer Part Number: PCR1J101MCL1GS; Stock 1: 11476; Pricing 1: 1=3.63000, 10=2.92800, 100=2.28380 (USD); RoHS: Yes; Mount: Surface Mount,PCB; Case/Package: Radial; Weight: 0.045856oz; Min Operating Temperature: -55°C; Max Operating Temperature: 125°C; Tolerance: 20%; Voltage Rating (DC): 63V; Package Quantity: 1; Packaging: Tape and Reel; Voltage Rating: 63V; Termination: SMD/SMT; Voltage: 63V; Diameter: 10mm; Length: 12.7mm; Height: 12.7mm; Height - Seated (Max): 0.504inch; Depth: 10.3mm; Lead Pitch: 4.6mm; Lead Free: Lead Free; ComponentLink1URL: https://datasheet.ciiva.com/29551/e-ch-ta-29551389.pdf?src-supplier=Digi-Key; ComponentLink1Description: https://datasheet.ciiva.com/29551/e-ch-ta-29551389.pdf?src-supplier=Digi-Key; ComponentLink2URL: https://datasheet.ciiva.com/29551/e-ch-ta-29551390.pdf?src-supplier=Digi-Key; ComponentLink2Description: https://datasheet.ciiva.com/29551/e-ch-ta-29551390.pdf?src-supplier=Digi-Key; ComponentLink3URL: https://datasheet.ciiva.com/29551/e-ch-ta-29551391.pdf?src-supplier=Digi-Key; ComponentLink3Description: https://datasheet.ciiva.com/29551/e-ch-ta-29551391.pdf?src-supplier=Digi-Key; Supplier Part Number 1: 493-13783-1-ND
F11 F12 = F2570CT: FUSE BOARD MNT 2A 63VAC/VDC 1206; Manufacturer: Littelfuse; Manufacturer Part Number: 0468002.NR; Voltage Rating (AC): 63V; Resistance: 32.4mR; Power Dissipation: 154.5mW; Fuse Type: Board Mount (Cartridge Style Excluded); Approvals: UL,CSA; Supplier 1: Digi-Key; Stock 1: 13091; Pricing 1: 1=1.2, 5=1.166, 10=1.091, 50=0.9028, 100=0.7524, 250=0.7336, 500=0.62074, 1000=0.54549 (USD); Mount: Surface Mount; Case/Package: 1206; Number of Pins: 2; Case Code (Metric): 3216; Case Code (Imperial): 1206; Terminal Material: Tin; Min Operating Temperature: -55°C; Max Operating Temperature: 90°C; Voltage Rating (DC): 63V; Packaging: Tape and Reel; Package Quantity: 5000; Voltage Rating: 63V; Termination: SMD/SMT; Composition: Thin Film; DC Cold Resistance: 32.4mR; Fuse Current: 2A; Length: 3.18mm; Height: 0.58mm; Width: 1.52mm; Depth: 1.52mm; Radiation Hardening: No; REACH SVHC: Unknown; Lead Free: Lead Free; ComponentLink1URL: http://www.farnell.com/datasheets/94905.pdf?src-supplier=Farnell; ComponentLink1Description: http://www.farnell.com/datasheets/94905.pdf?src-supplier=Farnell; ComponentLink2URL: http://www.littelfuse.com/~/media/electronics/datasheets/fuses/littelfuse_fuse_468_datasheet.pdf.pdf?src-supplier=Digi-Key; ComponentLink2Description: http://www.littelfuse.com/~/media/electronics/datasheets/fuses/littelfuse_fuse_468_datasheet.pdf.pdf?src-supplier=Digi-Key; ComponentLink3URL: http://www.farnell.com/datasheets/1851811.pdf?src-supplier=Element14; ComponentLink3Description: http://www.farnell.com/datasheets/1851811.pdf?src-supplier=Element14; ComponentLink4URL: http://www.littelfuse.com/~/media/electronics/datasheets/fuses/littelfuse_fuse_468_datasheet.pdf.pdf?src-supplier=Future+Electronics; ComponentLink4Description: http://www.littelfuse.com/~/media/electronics/datasheets/fuses/littelfuse_fuse_468_datasheet.pdf.pdf?src-supplier=Future+Electronics; Supplier Part Number 1: F2570DKR-ND
LED3 = LED GREEN 0603: as LED6 on sheet retros; Digikey P/N: 160-1435-1-ND; Package / Case: 0603; Color: GREEN
P17 P19 P20 = 43045-0200: as P5 on sheet arduino_shield; Supplier 1: Digi-Key; Manufacturer Part Number: 43045-0200; Stock 1: 6320; Pricing 1: 1=0.97000, 10=0.84900, 100=0.73280, 500=0.59958, 1000=0.53296, 5000=0.46634, 10000=0.44302 (USD); RoHS: Yes; Mount: Through Hole; Case/Package: SMC; Contact Plating: Tin; Color: Black; Contact Material: Brass,Tin; Housing Color: Black; Housing Material: Thermoplastic; Material: Thermoplastic; Min Operating Temperature: -40°C; Max Operating Temperature: 105°C; Termination: Through Hole; Number of Rows: 2; Orientation: Right Angle; Packaging: Tray; Number of Positions: 2; Package Quantity: 3168; Number of Circuits: 2; Contact Gender: Male; Diameter: 3mm; Row Spacing: 3mm; Radiation Hardening: No; Flammability Rating: UL94 V-0; REACH SVHC: Unknown; Lead Free: Lead Free; Halogen Free: Low Halogen; ComponentLink1URL: https://datasheet.ciiva.com/14155/04402310-14155203.pdf?src-supplier=Distrelec; ComponentLink1Description: https://datasheet.ciiva.com/14155/04402310-14155203.pdf?src-supplier=Distrelec; ComponentLink2URL: https://datasheet.ciiva.com/19454/883270-19454006.pdf?src-supplier=Jameco; ComponentLink2Description: https://datasheet.ciiva.com/19454/883270-19454006.pdf?src-supplier=Jameco; ComponentLink3URL: https://datasheet.ciiva.com/5150/0430450200-pcb-headers-145770-5150407.pdf?src-supplier=Mouser; ComponentLink3Description: https://datasheet.ciiva.com/5150/0430450200-pcb-headers-145770-5150407.pdf?src-supplier=Mouser; ComponentLink4URL: https://datasheet.ciiva.com/11747/0900766b80027348-11747001.pdf?src-supplier=RSComponents; ComponentLink4Description: https://datasheet.ciiva.com/11747/0900766b80027348-11747001.pdf?src-supplier=RSComponents; ComponentLink5URL: https://datasheet.ciiva.com/16656/0430450200-pcb-headers-16656330.pdf?src-supplier=Avnet+Europe; ComponentLink5Description: https://datasheet.ciiva.com/16656/0430450200-pcb-headers-16656330.pdf?src-supplier=Avnet+Europe; ComponentLink6URL: https://datasheet.ciiva.com/10090/0430450200-pcb-headers-10090299.pdf?src-supplier=Avnet; ComponentLink6Description: https://datasheet.ciiva.com/10090/0430450200-pcb-headers-10090299.pdf?src-supplier=Avnet; ComponentLink7URL: https://datasheet.ciiva.com/36854/124280430450200-pcb-headers-36854331.pdf?src-supplier=Onlinecomponents.com; ComponentLink7Description: https://datasheet.ciiva.com/36854/124280430450200-pcb-headers-36854331.pdf?src-supplier=Onlinecomponents.com; ComponentLink8URL: https://datasheet.ciiva.com/1443/1859921-1443437.pdf?src-supplier=Element14; ComponentLink8Description: https://datasheet.ciiva.com/1443/1859921-1443437.pdf?src-supplier=Element14
P18 = 43045-2000: HEADER, RIGHT ANGLE, 20WAY; Manufacturer: Molex; Number of Positions: 20; Contact Resistance: 10mR; Current Rating: 5A; Voltage Rating: 600V; Voltage Rating (AC): 250V; Max Voltage Rating (DC): 250.25kV; Gender: Male; Insulation Resistance: 1GR; Pitch: 3mm; Approvals: UL,CSA,TUV; Glow Wire Compliant: Compliant; Supplier 1: Digi-Key; Manufacturer Part Number: 43045-2000; Stock 1: 1197; Pricing 1: 1=5.17000, 10=4.95900, 100=4.13220, 500=3.51238, 1000=2.99585 (USD); RoHS: Yes; Mount: Through Hole; Contact Plating: Tin; Color: Black; Contact Material: Brass,Tin; Housing Color: Black; Housing Material: Thermoplastic; Material: Polyester; Min Operating Temperature: -40°C; Max Operating Temperature: 105°C; Number of Rows: 2; Termination: Solder; Packaging: Tray; Number of Contacts: 20; Package Quantity: 648; Orientation: Right Angle; Number of Poles: 20; Max Current Rating: 5A; Number of Circuits: 20; Working Voltage: 250V; Voltage Rating (DC): 250V; Operating Supply Voltage: 250V; Length: 34.15mm; Height: 8.77mm; Row Spacing: 3mm; Depth: 12.2mm; Lead Pitch: 3mm; Radiation Hardening: No; Flammability Rating: UL94 V-0; Halogen Free: Low Halogen; Lead Free: Lead Free; ComponentLink1URL: https://datasheet.ciiva.com/5158/0430452000-pcb-headers-143029-5158912.pdf?src-supplier=Mouser; ComponentLink1Description: https://datasheet.ciiva.com/5158/0430452000-pcb-headers-143029-5158912.pdf?src-supplier=Mouser; ComponentLink2URL: https://datasheet.ciiva.com/30232/144790430452000-pcb-headers-30232337.pdf?src-supplier=Onlinecomponents.com; ComponentLink2Description: https://datasheet.ciiva.com/30232/144790430452000-pcb-headers-30232337.pdf?src-supplier=Onlinecomponents.com; ComponentLink3URL: https://datasheet.ciiva.com/11747/0900766b80d6135b-11747452.pdf?src-supplier=RSComponents; ComponentLink3Description: https://datasheet.ciiva.com/11747/0900766b80d6135b-11747452.pdf?src-supplier=RSComponents; ComponentLink4URL: https://datasheet.ciiva.com/19461/800067-19461036.pdf?src-supplier=Jameco; ComponentLink4Description: https://datasheet.ciiva.com/19461/800067-19461036.pdf?src-supplier=Jameco; ComponentLink5URL: https://datasheet.ciiva.com/1443/1786399-1443623.pdf?src-supplier=Element14; ComponentLink5Description: https://datasheet.ciiva.com/1443/1786399-1443623.pdf?src-supplier=Element14; ComponentLink6URL: https://datasheet.ciiva.com/10076/0430452000-pcb-headers-10076859.pdf?src-supplier=Avnet; ComponentLink6Description: https://datasheet.ciiva.com/10076/0430452000-pcb-headers-10076859.pdf?src-supplier=Avnet; ComponentLink7URL: https://datasheet.ciiva.com/14155/04402310-14155212.pdf?src-supplier=Distrelec; ComponentLink7Description: https://datasheet.ciiva.com/14155/04402310-14155212.pdf?src-supplier=Distrelec; Supplier Part Number 1: WM4726-ND
P21 = 43045-0400: Male connector dual row 90° 3 mm Pole no. 2x2 Micro-Fit, 43045-0400, Molex; Contact Resistance: 10mR; Number of Contacts: 4; Max Voltage Rating (AC): 250V; Connector Type: Male Pin; Pitch: 3mm; Row Spacing: 0.118inch; Supplier 1: Digi-Key; Manufacturer: Molex; Manufacturer Part Number: 43045-0400; Stock 1: 5904; Pricing 1: 1=1.33000, 10=1.16700, 100=1.00670, 500=0.82368, 1000=0.73216, 5000=0.64064, 10000=0.60861 (USD); RoHS: Yes; Mount: Through Hole; Contact Plating: Tin; Color: Black; Contact Material: Brass; Housing Color: Black; Housing Material: Polymer; Min Operating Temperature: -40°C; Max Operating Temperature: 105°C; Number of Rows: 2; Termination: Solder; Packaging: Tray; Fastening Type: Ramp; Number of Positions: 4; Orientation: Right Angle; Length: 10.15mm; Depth: 12.2mm; Flammability Rating: UL94 V-0; ComponentLink1URL: https://datasheet.ciiva.com/712/430450200-sd-712017.pdf?src-supplier=Digi-Key; ComponentLink1Description: https://datasheet.ciiva.com/712/430450200-sd-712017.pdf?src-supplier=Digi-Key; ComponentLink2URL: https://datasheet.ciiva.com/20209/22-3744e-20209522.pdf?src-supplier=Rapid+Electronics; ComponentLink2Description: https://datasheet.ciiva.com/20209/22-3744e-20209522.pdf?src-supplier=Rapid+Electronics; ComponentLink3URL: https://datasheet.ciiva.com/11746/0900766b80027348-11746988.pdf?src-supplier=RSComponents; ComponentLink3Description: https://datasheet.ciiva.com/11746/0900766b80027348-11746988.pdf?src-supplier=RSComponents; ComponentLink4URL: https://datasheet.ciiva.com/30193/145420430450400-pcb-headers-30193310.pdf?src-supplier=Onlinecomponents.com; ComponentLink4Description: https://datasheet.ciiva.com/30193/145420430450400-pcb-headers-30193310.pdf?src-supplier=Onlinecomponents.com
R50 R52-R54 = ERJ-6GEY0R00V: as R168 on sheet retros; Part Number: ERJ-6GEY0R00V; Datasheets: http://industrial.panasonic.com/www-cgi/jvcr13pz.cgi?E+PZ+3+AOA0001+ERJ6GEY0R00V+7+WW; Image: //media.digikey.com/Renders/Panasonic%20Renders/ERJ-0805%20Pkg.jpg; Digi-Key Part Number: P0.0ACT-ND; Quantity Available: 1597627; Packaging: Cut Tape (CT); Series: ERJ; Part Status: Active; Value: 0.0; Tolerance: Jumper; Composition: Thick Film; Features: Automotive AEC-Q200; Temperature Coefficient: -; Operating Temperature: -55°C ~ 155°C; Package / Case: 0805 (2012 Metric); Supplier Device Package: 0805; Size / Dimension: 0.079" L x 0.049" W (2.00mm x 1.25mm); Height - Seated (Max): 0.028" (0.70mm); Number of Terminations: 2; Failure Rate: -; DNP: DNP
R51 R55 R56 = ERJ-P06J102V: RES SMD 1K OHM 5% 1/2W 0805; Manufacturer: Panasonic Electronic Components; Factory Stock: 0; Unit Price (USD): 0.01839; @ qty: 1500; Minimum Quantity: 1; Power (Watts): 0.5W, 1/2W; Temperature Coefficient: ±200ppm/°C; Part Number: ERJ-P06J102V; Datasheets: https://industrial.panasonic.com/cdbs/www-data/pdf/RDA0000/AOA0000C243.pdf; Image: //media.digikey.com/Renders/Panasonic%20Renders/ERJ-0805%20Pkg.jpg; Digi-Key Part Number: P1.0KADCT-ND; Quantity Available: 124757; Packaging: Cut Tape (CT); Series: ERJ; Part Status: Active; Value: 1k; Tolerance: ±5%; Composition: Thick Film; Features: Automotive AEC-Q200, Pulse Withstanding; Operating Temperature: -55°C ~ 155°C; Package / Case: 0805 (2012 Metric); Supplier Device Package: 0805; Size / Dimension: 0.079" L x 0.049" W (2.00mm x 1.25mm); Height - Seated (Max): 0.028" (0.70mm); Number of Terminations: 2; Failure Rate: -
S1 = CL-SB-22B-01T: SWITCH SLIDE DPDT 200MA 12V; Manufacturer: Nidec Copal; Actuator Material: Nylon,Polyamide; Contact Style: Non-Shorting; Electrical Life: 10000Cycles; Switch Travel: 2mm; Switch Function: On-On; Actuator Type: Standard; Operating Force: 153gf; Supplier 1: Digi-Key; Stock 1: 3664; Pricing 1: 1=1.02, 10=0.979, 25=0.9592, 50=0.857, 100=0.8162, 250=0.79584 (USD); Mount: Surface Mount; Contact Material: Copper; Contact Plating: Silver; Min Operating Temperature: -40°C; Max Operating Temperature: 85°C; Packaging: Tape and Reel; Current Rating: 200mA; Voltage Rating (DC): 12V; Throw Configuration: DPDT; Termination: Gull Wing; Actuator Length: 2mm; Lead Free: Lead Free; ComponentLink1URL: https://www.nidec-copal-electronics.com/e/catalog/switch/cl-sb.pdf?src-supplier=Digi-Key; ComponentLink1Description: https://www.nidec-copal-electronics.com/e/catalog/switch/cl-sb.pdf?src-supplier=Digi-Key; Supplier Part Number 1: 563-1342-6-ND